# Altium schematic sheet BLOCK DIAGRAM.SchDoc
size A3; Date: 20/09/2026; DrawnBy: Juan Alejandro Villodres Perdomo; Revision: 1.0; SheetNumber: 2; SheetTotal: 2; SheetDescription: Block diagram that describes the main sections of the designed PLC.
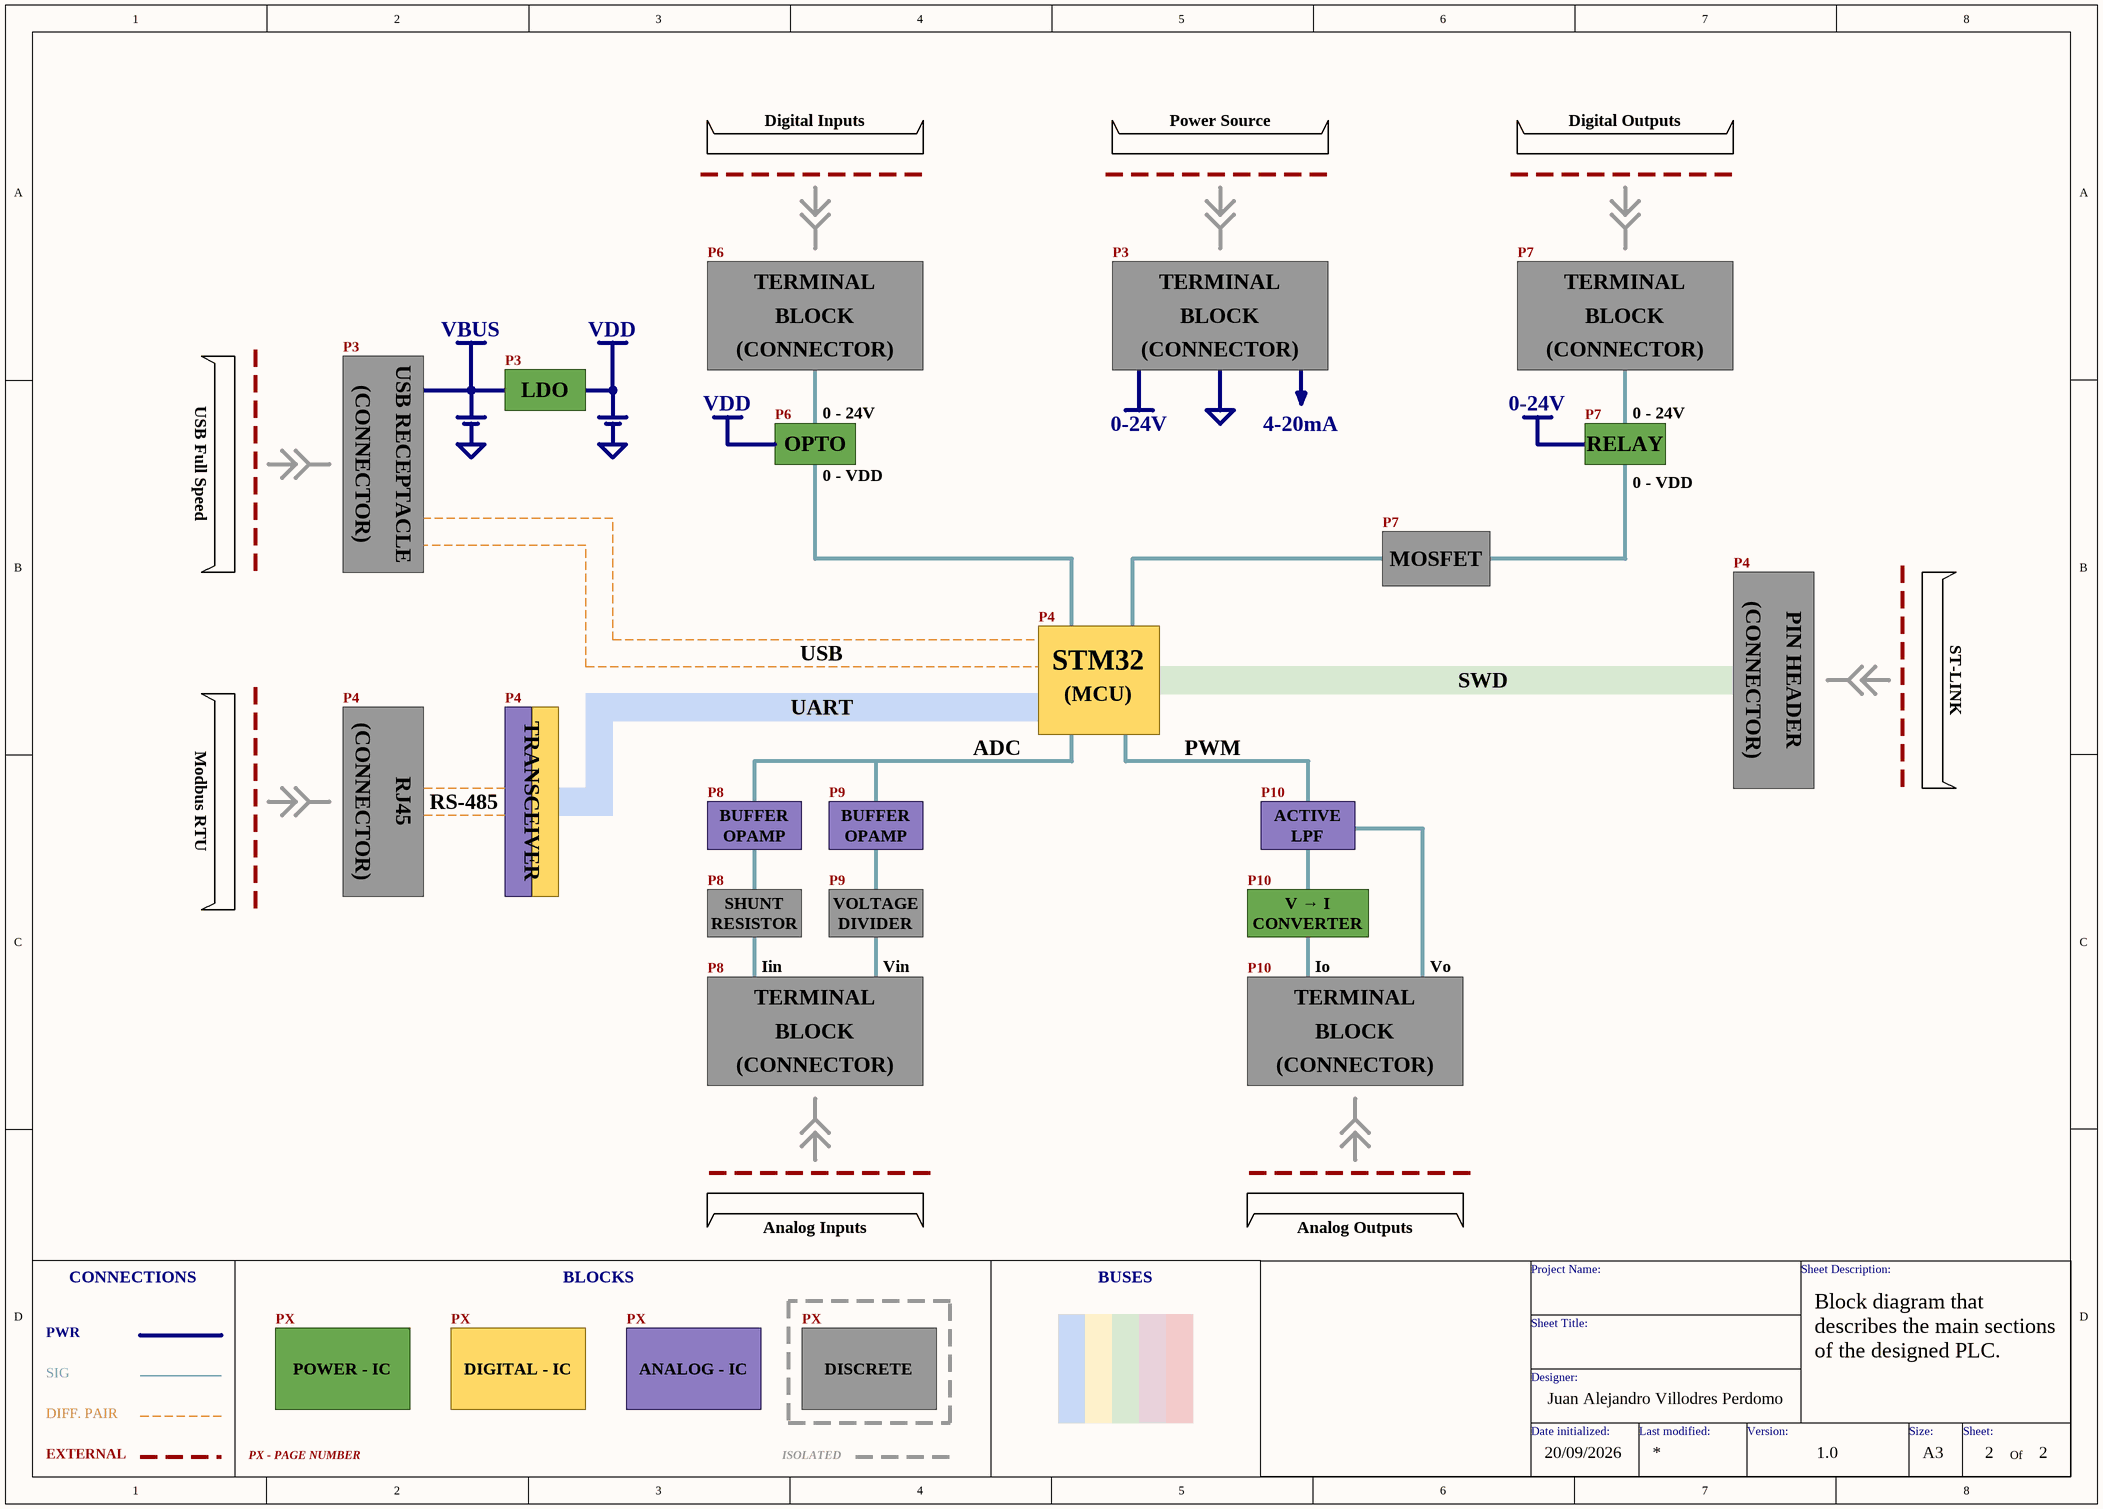
[diagram p0: BLOCK DIAGRAM.SchDoc]

## Notes on the sheet
- Digital Inputs
- Power Source
- Digital Outputs
- P6
- TERMINAL
- BLOCK
- P3
- P7
- VBUS
- VDD
- (CONNECTOR)
- LDO
- OPTO
- 0 - 24V
- 0-24V
- 4-20mA
- RELAY
- USB Full Speed
- USB RECEPTACLE
- 0 - VDD
- MOSFET
- P4
- USB
- UART
- STM32
- (MCU)
- SWD
- PIN HEADER
- ST-LINK
- ADC
- PWM
- Modbus RTU
- RJ45
- RS-485
- TRANSCEIVER
- P8
- BUFFER
- OPAMP
- P9
- P10
- ACTIVE
- LPF
- SHUNT
- RESISTOR
- VOLTAGE
- DIVIDER
- V → I
- CONVERTER
- Iin
- Vin
- Io
- Vo
- Analog Inputs
- Analog Outputs
- Project Name:
- Sheet Description:
- CONNECTIONS
- PX
- BLOCKS
- BUSES
- Sheet Title:
- PWR
- SIG
- POWER - IC
- DIGITAL - IC
- ANALOG - IC
- DISCRETE
- Designer:
- EXTERNAL
- DIFF. PAIR
- PX - PAGE NUMBER
- ISOLATED
- Date initialized:
- Last modified:
- Version:
- Size:
- A3
- Sheet:
- Of